# EAGLE schematic CHIP_PRO-Dev-Kit-v1.0 (EAGLE 8.2.2)

## Sheet 1 of 5
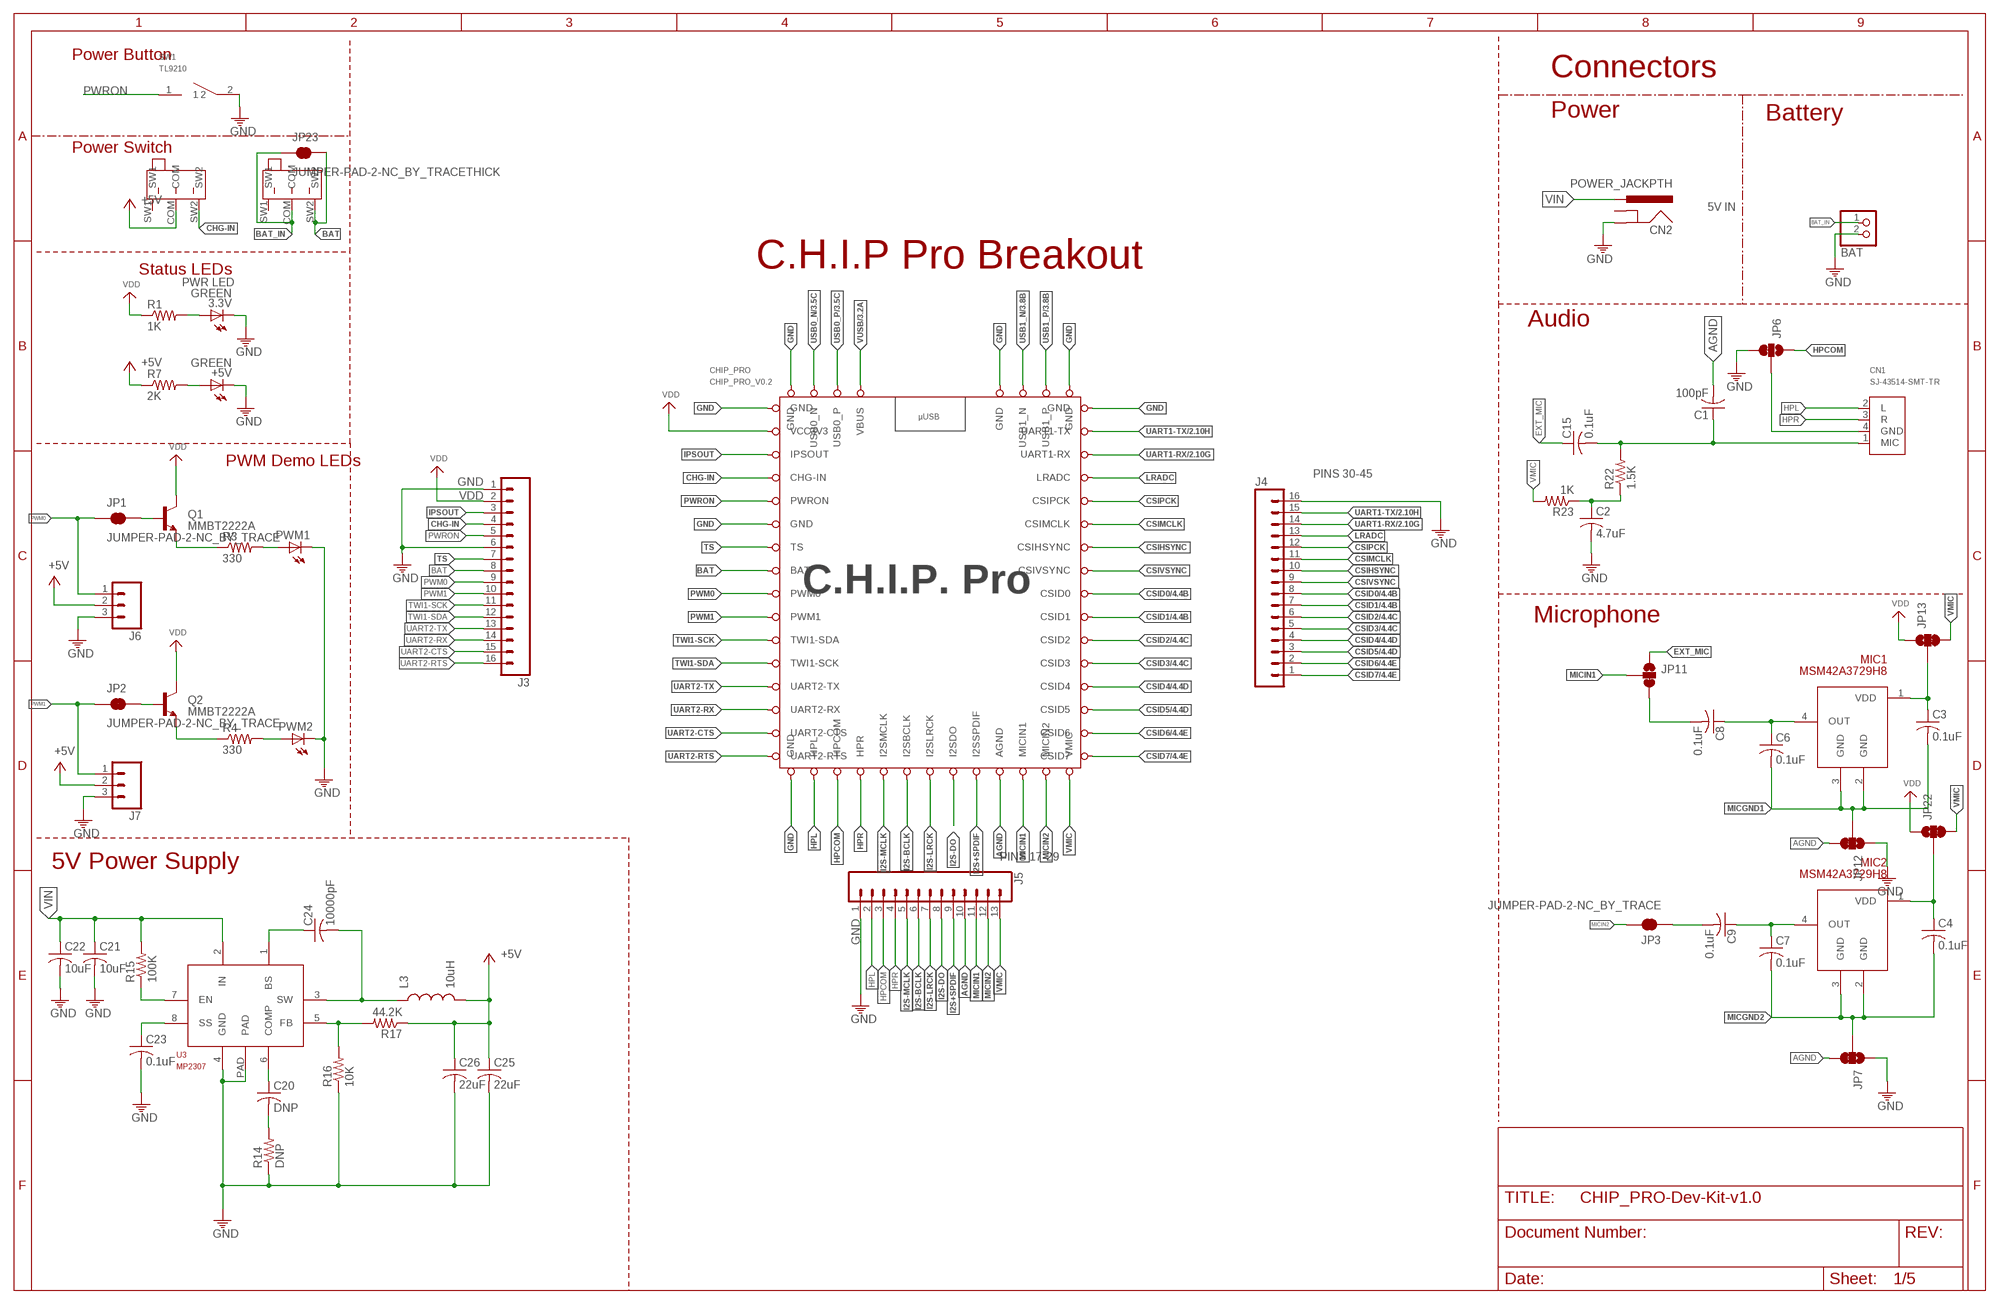
[diagram p0: schematic, sheet 1]

### Parts
3.3V  GREEN  LEDSMT1206  [1206]
+5V  GREEN  LEDSMT1206  [1206]
BAT  JST_2PIN-SMT-RA  [JST-PH-2-SMT-RA]
C1  100pF  C-USC0402  [C0402]
C2  4.7uF  C-USC0402  [C0402]
C3  0.1uF  C-USC0402  [C0402]
C4  0.1uF  C-USC0402  [C0402]
C6  0.1uF  C-USC0402  [C0402]
C7  0.1uF  C-USC0402  [C0402]
C8  0.1uF  C-USC0402  [C0402]
C9  0.1uF  C-USC0402  [C0402]
C15  0.1uF  C-USC0402  [C0402]
C20  DNP  C-USC0402  [C0402]
C21  10uF  C-USC0603  [C0603]
C22  10uF  C-USC0603  [C0603]
C23  0.1uF  C-USC0402  [C0402]
C24  10000pF  C-USC0603  [C0603]
C25  22uF  C-USC0805  [C0805]
C26  22uF  C-USC0805  [C0805]
CHIP_PRO  CHIP_PRO_V0.2  GR8_MODULE_V0.1  [GR8_MODULE_V0.2]
CN1  SJ-43514-SMT-TR  [SJ-43514-SMT-TR]
CN2  POWER_JACKPTH  [POWER_JACK_PTH]
J3  M16LOCK_LONGPADS  [1X16_LOCK_LONGPADS]
J4  M16LOCK_LONGPADS  [1X16_LOCK_LONGPADS]
J5  M13LOCK  [1X13_LOCK]
J6  M03LOCK  [1X03_LOCK]
J7  M03LOCK  [1X03_LOCK]
JP1  JUMPER-PAD-2-NC_BY_TRACE  [PAD-JUMPER-2-NC_BY_TRACE_YES_SILK]
JP2  JUMPER-PAD-2-NC_BY_TRACE  [PAD-JUMPER-2-NC_BY_TRACE_YES_SILK]
JP3  JUMPER-PAD-2-NC_BY_TRACE  [PAD-JUMPER-2-NC_BY_TRACE_YES_SILK]
JP6  JUMPER-PAD-3-2OF3_NC_BY_TRACE_LARGE  [PAD-JUMPER-3-2OF3_NC_BY_TRACE_YES_SILK_LARGE]
JP7  JUMPER-PAD-3-2OF3_NC_BY_TRACE_LARGE  [PAD-JUMPER-3-2OF3_NC_BY_TRACE_YES_SILK_LARGE]
JP11  JUMPER-PAD-3-2OF3_NC_BY_TRACE_LARGE  [PAD-JUMPER-3-2OF3_NC_BY_TRACE_YES_SILK_LARGE]
JP12  JUMPER-PAD-3-2OF3_NC_BY_TRACE_LARGE  [PAD-JUMPER-3-2OF3_NC_BY_TRACE_YES_SILK_LARGE]
JP13  JUMPER-PAD-3-2OF3_NC_BY_TRACE_LARGE  [PAD-JUMPER-3-2OF3_NC_BY_TRACE_YES_SILK_LARGE]
JP22  JUMPER-PAD-3-2OF3_NC_BY_TRACE_LARGE  [PAD-JUMPER-3-2OF3_NC_BY_TRACE_YES_SILK_LARGE]
JP23  JUMPER-PAD-2-NC_BY_TRACETHICK  [PAD-JUMPER-2-NC_BY_TRACE_YES_SILK_THICK]
L3  10uH  INDUCTORNR8040  [INDUCTOR_NR8040]
MIC1  MSM42A3729H8  [MSM42A3729H8]
MIC2  MSM42A3729H8  [MSM42A3729H8]
PWM1  LEDSMT1206  [1206]
PWM2  LEDSMT1206  [1206]
Q1  MMBT2222A  TRANSISTOR_NPNMMBT2222A  [SOT23-3]
Q2  MMBT2222A  TRANSISTOR_NPNMMBT2222A  [SOT23-3]
R1  1K  R-US_R0603  [R0603]
R3  330  R-US_R0603  [R0603]
R4  330  R-US_R0603  [R0603]
R7  2K  R-US_R0603  [R0603]
R14  DNP  R-US_R0402  [R0402]
R15  100K  R-US_R0402  [R0402]
R16  10K  R-US_R0402  [R0402]
R17  44.2K  R-US_R0402  [R0402]
R22  1.5K  R-US_R0402  [R0402]
R23  1K  R-US_R0402  [R0402]
SW1  TL9210  [TL9210_SW]
SW2  SLIDE_SWITCHESYSS-19-1202-N  [YSS-19-1202-N]
SW3  SLIDE_SWITCHESYSS-19-1202-N  [YSS-19-1202-N]
U3  MP2307  [SOIC-8-PAD]

### Nets
+5V: C25.1 C26.1 J6.2 J7.2 L3.P$2 R7.1 R17.1 SW2.COM ; also sheet 3
AGND: C1.2 CHIP_PRO.AGND J5.10 JP7.3 JP12.3
BAT: CHIP_PRO.BAT J3.8 JP23.2 SW3.SW2
BAT_IN: BAT.1 JP23.1 SW3.COM
CHG-IN: CHIP_PRO.CHG-IN J3.4 SW2.SW2
CSID0: CHIP_PRO.CSID0 J4.8 ; also sheet 4
CSID1: CHIP_PRO.CSID1 J4.7 ; also sheet 4
CSID2: CHIP_PRO.CSID2 J4.6 ; also sheet 4
CSID3: CHIP_PRO.CSID3 J4.5 ; also sheet 4
CSID4: CHIP_PRO.CSID4 J4.4 ; also sheet 4
CSID5: CHIP_PRO.CSID5 J4.3 ; also sheet 4
CSID6: CHIP_PRO.CSID6 J4.2 ; also sheet 4
CSID7: CHIP_PRO.CSID7 J4.1 ; also sheet 4
CSIHSYNC: CHIP_PRO.CSIHSYNC J4.10
CSIMCLK: CHIP_PRO.CSIMCLK J4.11
CSIPCK: CHIP_PRO.CSIPCK J4.12
CSIVSYNC: CHIP_PRO.CSIVSYNC J4.9
EXT_MIC: C15.1 JP11.1
GND: 3.3V.C +5V.C BAT.2 C2.2 C21.2 C22.2 C23.2 C25.2 C26.2 CHIP_PRO.GND@0(GND) CHIP_PRO.GND@1(GND) CHIP_PRO.GND@2(GND) CHIP_PRO.GND@3(GND) CHIP_PRO.GND@4(GND) CHIP_PRO.GND@6(GND) CHIP_PRO.GND@7(GND) CN2.GND J3.1 J3.6 J4.16 J5.1 J6.3 J7.3 JP6.3 JP7.1 JP12.1 PWM1.C PWM2.C R14.1 R16.1 SW1.2 U3.4(GND) U3.PAD ; also sheet 2,3,4
HPCOM: CHIP_PRO.HPCOM J5.3 JP6.1
HPL: CHIP_PRO.HPL CN1.2(L) J5.2
HPR: CHIP_PRO.HPR CN1.3(R) J5.4
I2S+SPDIF: CHIP_PRO.I2S+SPDIF(I2SSPDIF) J5.9
I2S-BCLK: CHIP_PRO.I2S-BCLK(I2SBCLK) J5.6
I2S-DO: CHIP_PRO.I2S-DO(I2SDO) J5.8
I2S-LRCK: CHIP_PRO.I2S-LRCK(I2SLRCK) J5.7
I2S-MCLK: CHIP_PRO.I2S-MCLK(I2SMCLK) J5.5
IPSOUT: CHIP_PRO.IPSOUT J3.3
LRADC: CHIP_PRO.LRADC J4.13
MICGND1: C3.2 C6.2 JP12.2 MIC1.2(GND) MIC1.3(GND)
MICGND2: C4.2 C7.2 JP7.2 MIC2.2(GND) MIC2.3(GND)
MICIN1: CHIP_PRO.MICIN1 J5.11 JP11.2
MICIN2: CHIP_PRO.MICIN2 J5.12 JP3.2
N$1: 3.3V.A R1.2
N$2: C3.1 JP13.2 MIC1.1(VDD)
N$3: C6.1 C8.1 MIC1.4(OUT)
N$4: JP1.2 Q1.1(B)
N$5: JP2.2 Q2.1(B)
N$6: C8.2 JP11.3
N$8: Q1.2(E) R3.1
N$9: PWM1.A R3.2
N$10: Q2.2(E) R4.1
N$11: PWM2.A R4.2
N$18: R15.1 U3.7(EN)
N$19: C23.1 U3.8(SS)
N$21: CN1.4(GND) JP6.2
N$22: C20.2 R14.2
N$23: C20.1 U3.6(COMP)
N$24: C24.1 U3.1(BS)
N$25: C24.2 L3.P$1 U3.3(SW)
N$26: C1.1 C15.2 CN1.1(MIC) R22.2
N$27: R16.2 R17.2 U3.5(FB)
N$28: C2.1 R22.1 R23.1
N$32: +5V.A R7.2
N$34: C7.1 C9.1 MIC2.4(OUT)
N$35: C4.1 JP22.2 MIC2.1(VDD)
N$48: C9.2 JP3.1
PWM0: CHIP_PRO.PWM0 J3.9 J6.1 JP1.1
PWM1: CHIP_PRO.PWM1 J3.10 J7.1 JP2.1
PWRON: CHIP_PRO.PWRON J3.5 SW1.1
TS: CHIP_PRO.TS J3.7
TWI1-SCK: CHIP_PRO.TWI1-SDA J3.11
TWI1-SDA: CHIP_PRO.TWI1-SCK J3.12
UART1-RX: CHIP_PRO.UART1-RX J4.14 ; also sheet 2
UART1-TX: CHIP_PRO.UART1-TX J4.15 ; also sheet 2
UART2-CTS: CHIP_PRO.UART2-CTS J3.15
UART2-RTS: CHIP_PRO.UART2-RTS J3.16
UART2-RX: CHIP_PRO.UART2-RX J3.14
UART2-TX: CHIP_PRO.UART2-TX J3.13
USB0_N: CHIP_PRO.USB0_N ; also sheet 3
USB0_P: CHIP_PRO.USB0_P ; also sheet 3
USB1_N: CHIP_PRO.USB1_N ; also sheet 3
USB1_P: CHIP_PRO.USB1_P ; also sheet 3
VDD: CHIP_PRO.VCC3V3 J3.2 JP13.1 JP22.1 Q1.3(C) Q2.3(C) R1.1 ; also sheet 2,3,4
VIN: C21.1 C22.1 CN2.PWR R15.2 U3.2(IN)
VMIC: CHIP_PRO.VMIC J5.13 JP13.3 JP22.3 R23.2
VUSB: CHIP_PRO.VBUS ; also sheet 3
Unconnected: CN2.GNDBREAK SW2.SW1 SW3.SW1

### Notes on the sheet
- Power Button
- Connectors
- Power | Battery
- Power Switch
- 5V IN
- C.H.I.P Pro Breakout
- Status LEDs
- PWR LED
- Audio
- PWM Demo LEDs
- PINS 30-45
- Microphone
- PINS 17-29
- 5V Power Supply

## Sheet 2 of 5
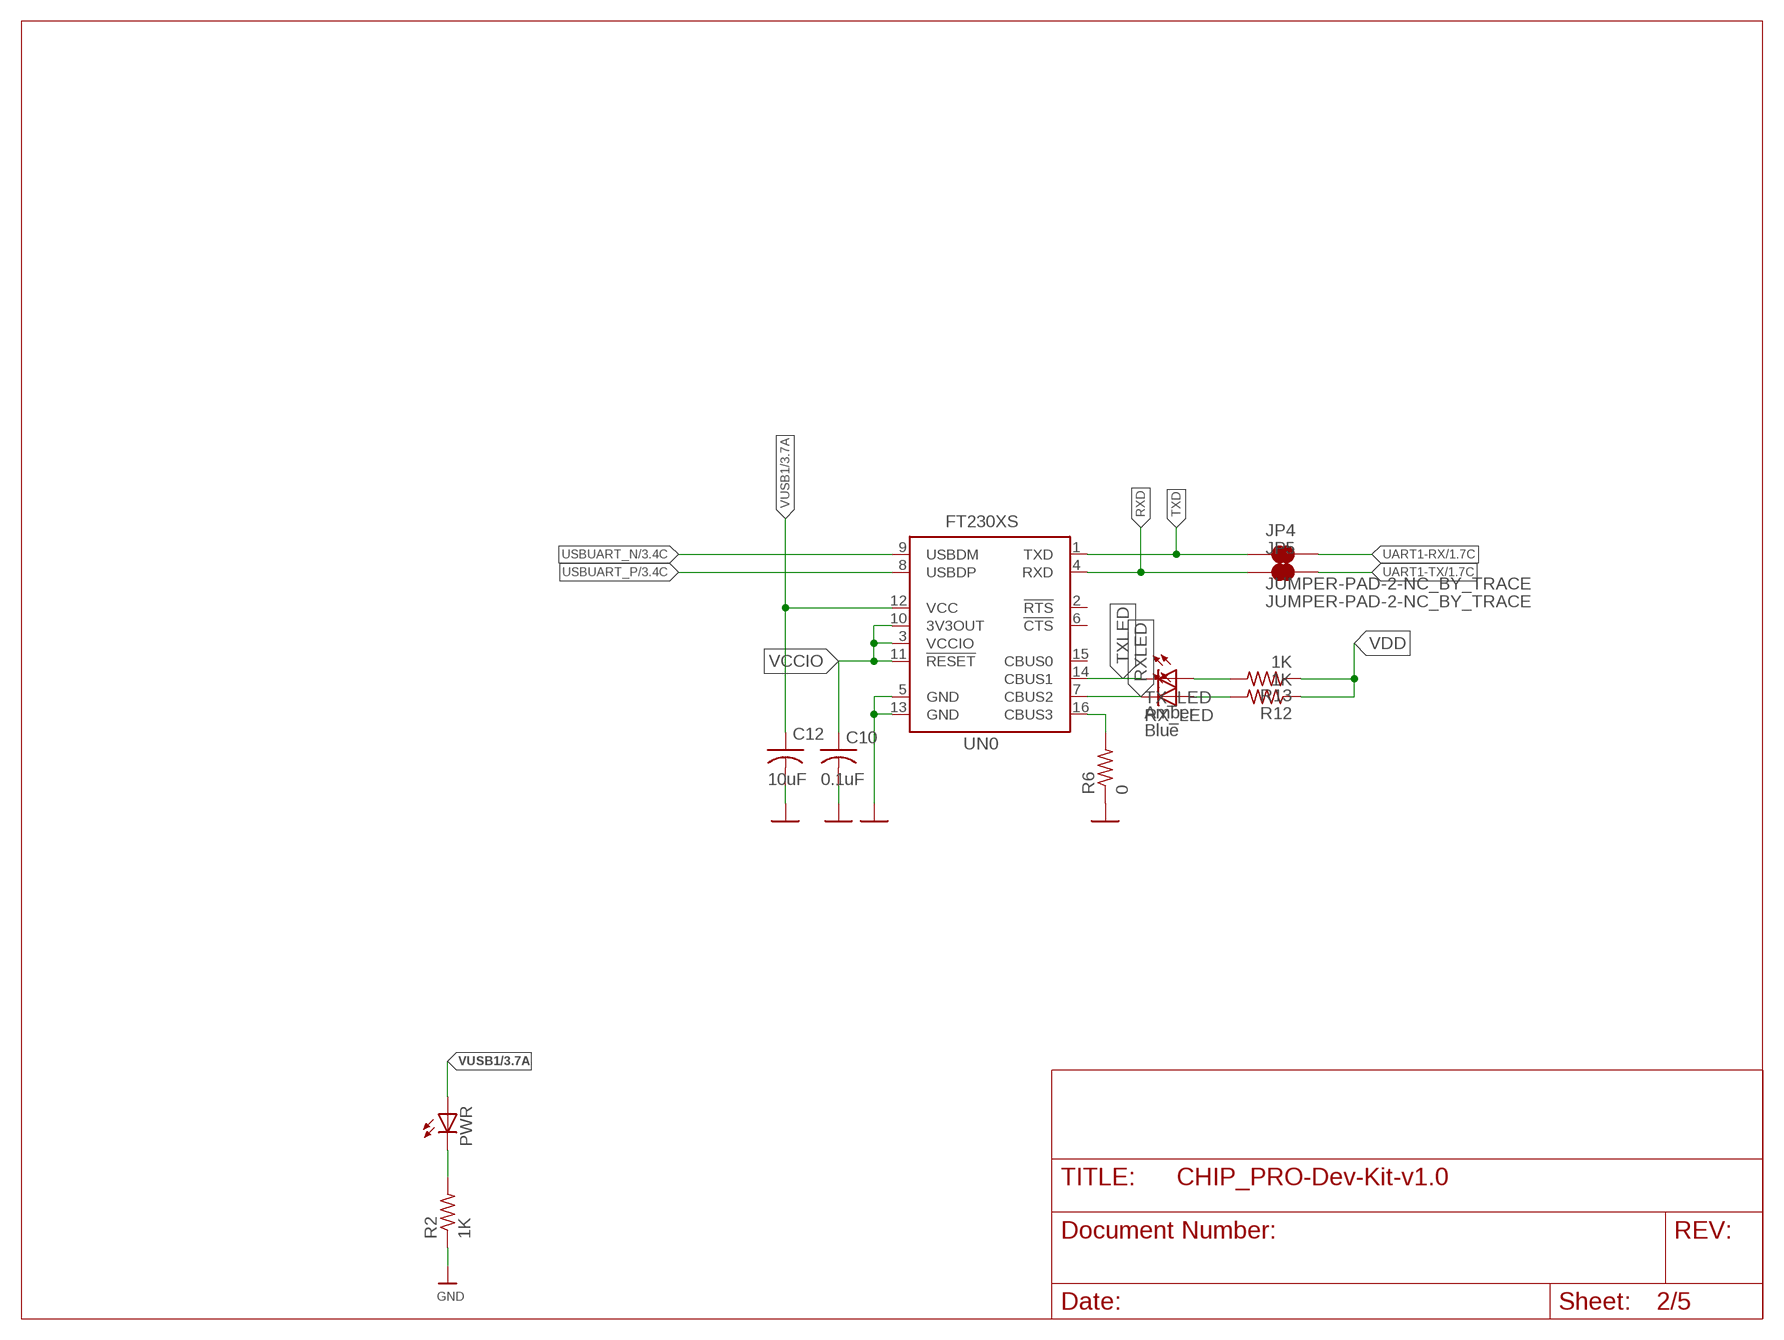
[diagram p1: schematic, sheet 2]

### Parts
C10  0.1uF  C-USC0402  [C0402]
C12  10uF  C-USC0402  [C0402]
JP4  JUMPER-PAD-2-NC_BY_TRACE  [PAD-JUMPER-2-NC_BY_TRACE_YES_SILK]
JP5  JUMPER-PAD-2-NC_BY_TRACE  [PAD-JUMPER-2-NC_BY_TRACE_YES_SILK]
PWR  LED805  [LED-805]
R2  1K  R-US_R0402  [R0402]
R6  0  R-US_R0402  [R0402]
R12  1K  R-US_R0402  [R0402]
R13  1K  R-US_R0402  [R0402]
RX_LED  Blue  LED805  [LED-805]
TX_LED  Amber  LED805  [LED-805]
UN0  FT230XS  [SSOP-16]

### Nets
GND: C10.2 C12.2 R2.1 R6.1 UN0.5(GND) UN0.13(GND) ; also sheet 1,3,4
N$14: PWR.C R2.2
N$15: R12.2 RX_LED.A
N$16: R13.2 TX_LED.A
N$58: R6.2 UN0.16(CBUS3)
RXD: JP5.1 UN0.4(RXD)
RXLED: RX_LED.C UN0.7(CBUS2)
TXD: JP4.1 UN0.1(TXD)
TXLED: TX_LED.C UN0.14(CBUS1)
UART1-RX: JP4.2 ; also sheet 1
UART1-TX: JP5.2 ; also sheet 1
USBUART_N: UN0.9(USBDM) ; also sheet 3
USBUART_P: UN0.8(USBDP) ; also sheet 3
VCCIO: C10.1 UN0.3(VCCIO) UN0.10(3V3OUT) UN0.11(!RESET)
VDD: R12.1 R13.1 ; also sheet 1,3,4
VUSB1: C12.1 PWR.A UN0.12(VCC) ; also sheet 3
Unconnected: UN0.2(!RTS) UN0.6(!CTS) UN0.15(CBUS0)

## Sheet 3 of 5
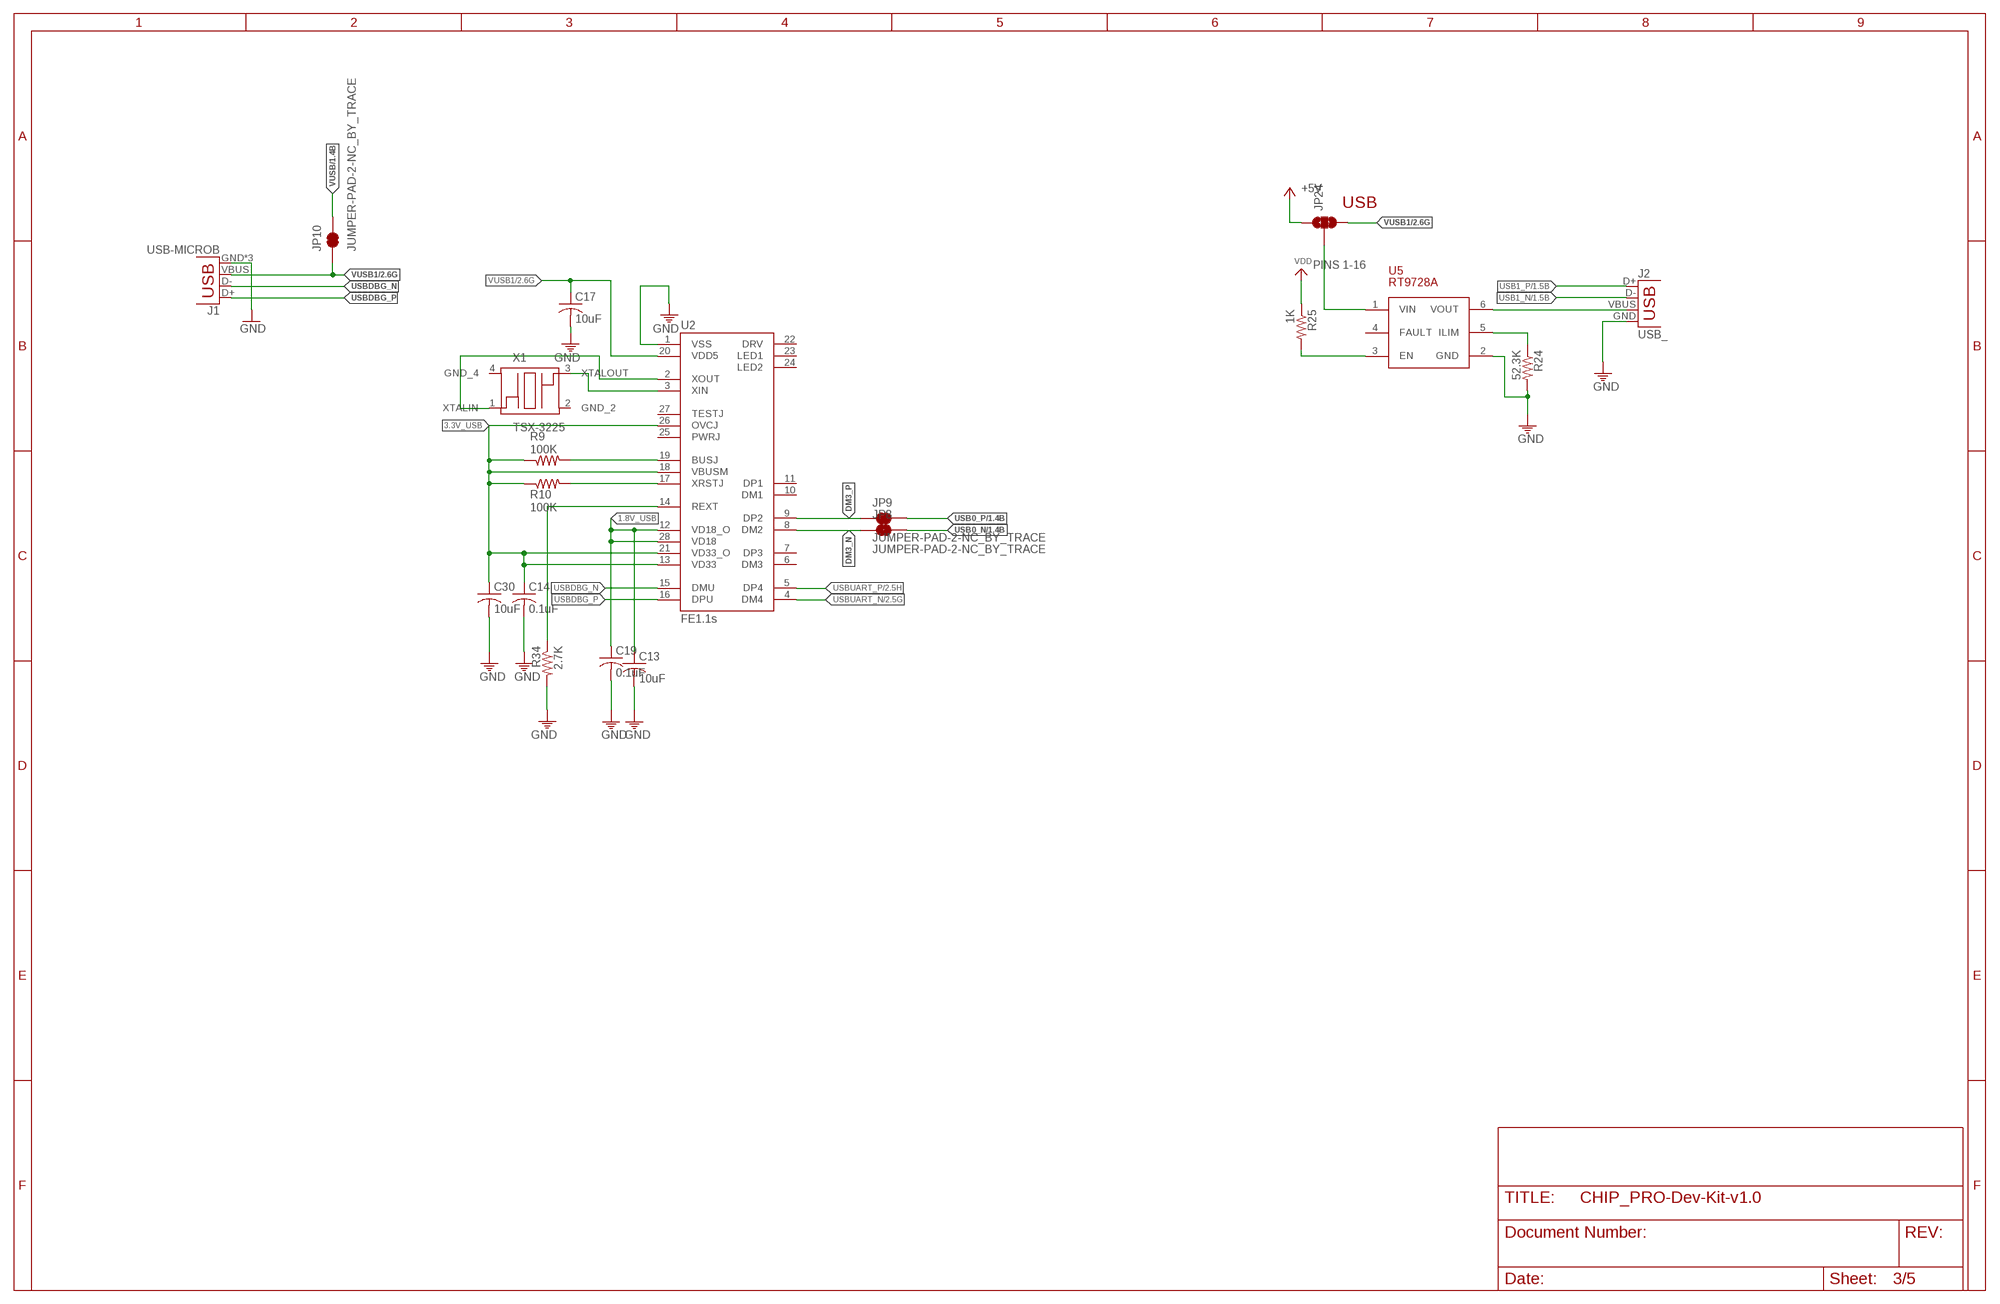
[diagram p2: schematic, sheet 3]

### Parts
C13  10uF  C-USC0603  [C0603]
C14  0.1uF  C-USC0402  [C0402]
C17  10uF  C-USC0603  [C0603]
C19  0.1uF  C-USC0402  [C0402]
C30  10uF  C-USC0603  [C0603]
J1  USB-MICROB  [USB-MICROB]
J2  USB_  [USB-A-S-SILK-FEMALE]
JP8  JUMPER-PAD-2-NC_BY_TRACE  [PAD-JUMPER-2-NC_BY_TRACE_YES_SILK]
JP9  JUMPER-PAD-2-NC_BY_TRACE  [PAD-JUMPER-2-NC_BY_TRACE_YES_SILK]
JP10  JUMPER-PAD-2-NC_BY_TRACE  [PAD-JUMPER-2-NC_BY_TRACE_YES_SILK]
JP24  JUMPER-PAD-3-2OF3_NC_BY_TRACE_LARGE  [PAD-JUMPER-3-2OF3_NC_BY_TRACE_YES_SILK_LARGE]
R9  100K  R-US_R0402  [R0402]
R10  100K  R-US_R0402  [R0402]
R24  52.3K  R-US_R0402  [R0402]
R25  1K  R-US_R0402  [R0402]
R34  2.7K  R-US_R0402  [R0402]
U2  FE1.1S  [FE1.1S_SSOP-28]
U5  RT9728A  [SOT-23-6]
X1  TSX-3225  [TSX-3225]

### Nets
1.8V_USB: C13.1 C19.1 U2.12(VD18_O) U2.28(VD18)
3.3V_USB: C14.1 C30.1 R9.1 R10.1 U2.13(VD33) U2.18(VBUSM) U2.21(VD33_O) U2.26(OVCJ)
+5V: JP24.1 ; also sheet 1
DM3_N: JP8.1 U2.8(DM2)
DM3_P: JP9.1 U2.9(DP2)
GND: C13.2 C14.2 C17.2 C19.2 C30.2 J1.GND J1.MT1(GND) J1.MT2(GND) J2.GND R24.2 R34.2 U2.1(VSS) U5.2(GND) ; also sheet 1,2,4
N$12: R9.2 U2.19(BUSJ)
N$13: JP24.2 U5.1(VIN)
N$17: J2.VBUS U5.6(VOUT)
N$20: R34.1 U2.14(REXT)
N$30: U2.3(XIN) X1.3(XTALOUT)
N$31: R10.2 U2.17(XRSTJ)
N$33: R25.2 U5.3(EN)
N$36: R24.1 U5.5(ILIM)
N$49: U2.2(XOUT) X1.1(XTALIN)
USB0_N: JP8.2 ; also sheet 1
USB0_P: JP9.2 ; also sheet 1
USB1_N: J2.D- ; also sheet 1
USB1_P: J2.D+ ; also sheet 1
USBDBG_N: J1.D- U2.15(DMU)
USBDBG_P: J1.D+ U2.16(DPU)
USBUART_N: U2.4(DM4) ; also sheet 2
USBUART_P: U2.5(DP4) ; also sheet 2
VDD: R25.1 ; also sheet 1,2,4
VUSB: JP10.2 ; also sheet 1
VUSB1: C17.1 J1.VBUS JP10.1 JP24.3 U2.20(VDD5) ; also sheet 2
Unconnected: U2.6(DM3) U2.7(DP3) U2.10(DM1) U2.11(DP1) U2.22(DRV) U2.23(LED1) U2.24(LED2) U2.25(PWRJ) U2.27(TESTJ) U5.4(FAULT) X1.2(GND_2) X1.4(GND_4)

### Notes on the sheet
- USB
- PINS 1-16

## Sheet 4 of 5
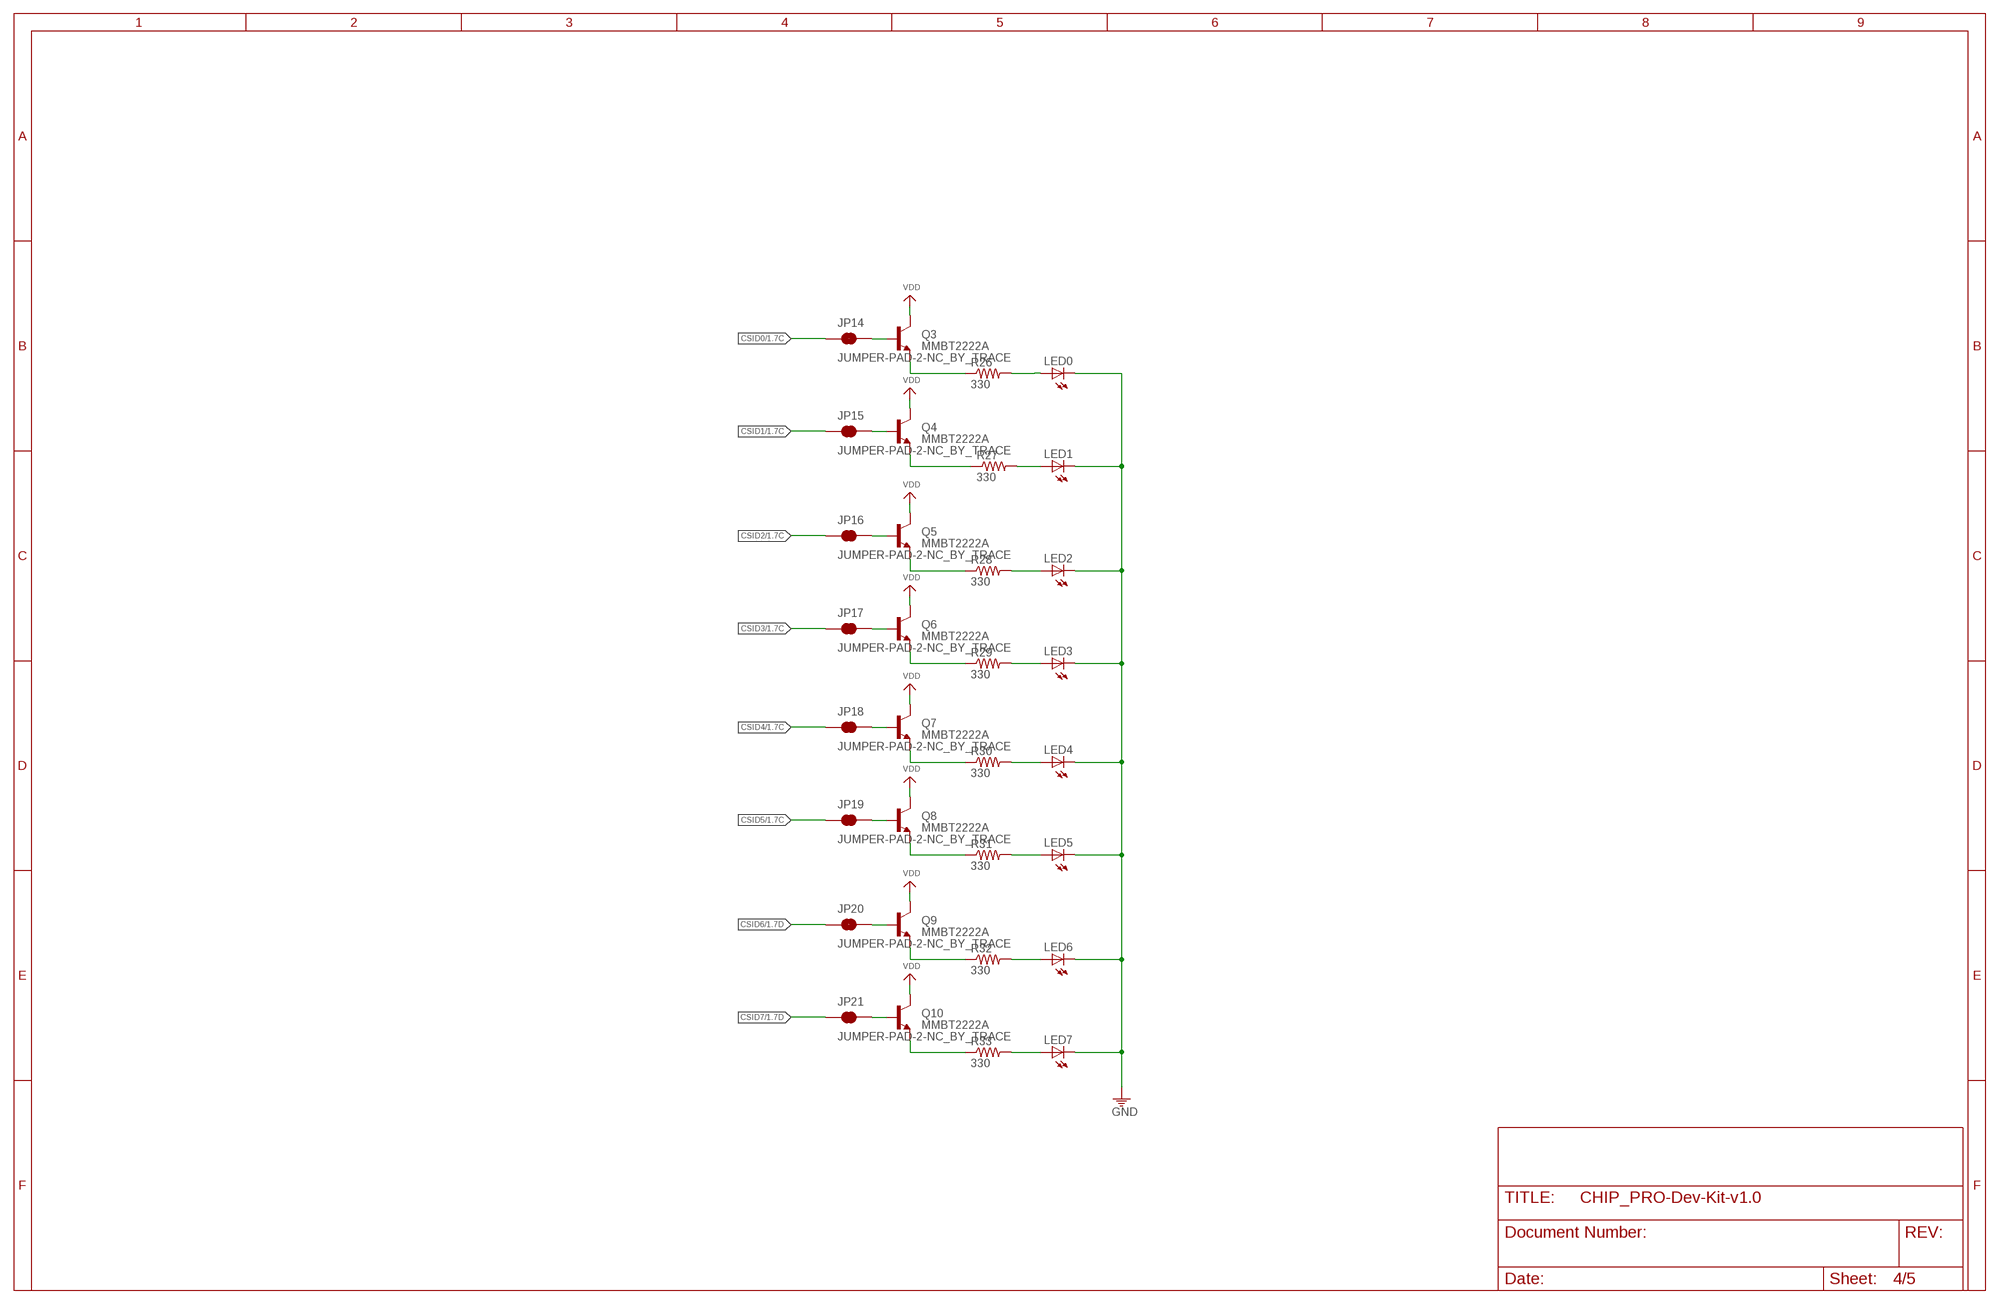
[diagram p3: schematic, sheet 4]

### Parts
JP14  JUMPER-PAD-2-NC_BY_TRACE  [PAD-JUMPER-2-NC_BY_TRACE_YES_SILK]
JP15  JUMPER-PAD-2-NC_BY_TRACE  [PAD-JUMPER-2-NC_BY_TRACE_YES_SILK]
JP16  JUMPER-PAD-2-NC_BY_TRACE  [PAD-JUMPER-2-NC_BY_TRACE_YES_SILK]
JP17  JUMPER-PAD-2-NC_BY_TRACE  [PAD-JUMPER-2-NC_BY_TRACE_YES_SILK]
JP18  JUMPER-PAD-2-NC_BY_TRACE  [PAD-JUMPER-2-NC_BY_TRACE_YES_SILK]
JP19  JUMPER-PAD-2-NC_BY_TRACE  [PAD-JUMPER-2-NC_BY_TRACE_YES_SILK]
JP20  JUMPER-PAD-2-NC_BY_TRACE  [PAD-JUMPER-2-NC_BY_TRACE_YES_SILK]
JP21  JUMPER-PAD-2-NC_BY_TRACE  [PAD-JUMPER-2-NC_BY_TRACE_YES_SILK]
LED0  LEDSMT1206  [1206]
LED1  LEDSMT1206  [1206]
LED2  LEDSMT1206  [1206]
LED3  LEDSMT1206  [1206]
LED4  LEDSMT1206  [1206]
LED5  LEDSMT1206  [1206]
LED6  LEDSMT1206  [1206]
LED7  LEDSMT1206  [1206]
Q3  MMBT2222A  TRANSISTOR_NPNMMBT2222A  [SOT23-3]
Q4  MMBT2222A  TRANSISTOR_NPNMMBT2222A  [SOT23-3]
Q5  MMBT2222A  TRANSISTOR_NPNMMBT2222A  [SOT23-3]
Q6  MMBT2222A  TRANSISTOR_NPNMMBT2222A  [SOT23-3]
Q7  MMBT2222A  TRANSISTOR_NPNMMBT2222A  [SOT23-3]
Q8  MMBT2222A  TRANSISTOR_NPNMMBT2222A  [SOT23-3]
Q9  MMBT2222A  TRANSISTOR_NPNMMBT2222A  [SOT23-3]
Q10  MMBT2222A  TRANSISTOR_NPNMMBT2222A  [SOT23-3]
R26  330  R-US_R0603  [R0603]
R27  330  R-US_R0603  [R0603]
R28  330  R-US_R0603  [R0603]
R29  330  R-US_R0603  [R0603]
R30  330  R-US_R0603  [R0603]
R31  330  R-US_R0603  [R0603]
R32  330  R-US_R0603  [R0603]
R33  330  R-US_R0603  [R0603]

### Nets
CSID0: JP14.1 ; also sheet 1
CSID1: JP15.1 ; also sheet 1
CSID2: JP16.1 ; also sheet 1
CSID3: JP17.1 ; also sheet 1
CSID4: JP18.1 ; also sheet 1
CSID5: JP19.1 ; also sheet 1
CSID6: JP20.1 ; also sheet 1
CSID7: JP21.1 ; also sheet 1
GND: LED0.C LED1.C LED2.C LED3.C LED4.C LED5.C LED6.C LED7.C ; also sheet 1,2,3
N$37: JP14.2 Q3.1(B)
N$39: Q3.2(E) R26.1
N$40: JP15.2 Q4.1(B)
N$41: Q4.2(E) R27.1
N$42: JP16.2 Q5.1(B)
N$43: Q5.2(E) R28.1
N$44: JP17.2 Q6.1(B)
N$46: Q6.2(E) R29.1
N$47: JP18.2 Q7.1(B)
N$50: Q7.2(E) R30.1
N$51: JP19.2 Q8.1(B)
N$52: Q8.2(E) R31.1
N$53: JP20.2 Q9.1(B)
N$54: Q9.2(E) R32.1
N$55: JP21.2 Q10.1(B)
N$56: Q10.2(E) R33.1
N$68: LED7.A R33.2
N$69: LED6.A R32.2
N$70: LED5.A R31.2
N$71: LED4.A R30.2
N$72: LED3.A R29.2
N$73: LED2.A R28.2
N$74: LED1.A R27.2
N$75: LED0.A R26.2
VDD: Q3.3(C) Q4.3(C) Q5.3(C) Q6.3(C) Q7.3(C) Q8.3(C) Q9.3(C) Q10.3(C) ; also sheet 1,2,3

## Sheet 5 of 5

## Library data of the parts
3.3V +5V LED0 LED1-LED7 PWM1 PWM2 = adafruit:LED: LED OSRAM: - CHIPLED LG R971, LG N971, LY N971, LG Q971, LY Q971, LO R971, LY R971 LH N974, LH R974 LS Q976, LO Q976, LY Q976 LO Q996 - Hyper CHIPLED LW Q18S LB Q993, LB Q99A, LB R99A - SideLED LS A670, LO A670, LY A670, LG A670, LP A670 LB A673, LV A673, LT A673, LW A673 LH A674 LY A675 LS A676, LA A676, LO A676, LY A676, LW A676 LS A679, LY A679, LG A679 - Hyper Micro SIDELED® LS Y876, LA Y876, LO Y876, LY Y876 LT Y87S - SmartLED LW L88C, LW L88S LB L89C, LB L89S, LG L890 LS L89K, LO L89K, LY L89K LS L896, LA L896, LO L896, LY L896 - TOPLED LS T670, LO T670, LY T670, LG T670, LP T670 LSG T670, LSP T670, LSY T670, LOP T670, LYG T670 LG T671, LOG T671, LSG T671 LB T673, LV T673, LT T673, LW T673 LH T674 LS T676, LA T676, LO T676, LY T676, LB T676, LH T676, LSB T676, LW T676 LB T67C, LV T67C, LT T67C, LS T67K, LO T67K, LY T67K, LW E67C LS E67B, LA E67B, LO E67B, LY E67B, LB E67C, LV E67C, LT E67C LW T67C LS T679, LY T679, LG T679 LS T770, LO T770, LY T770, LG T770, LP T770 LB T773, LV T773, LT T773, LW T773 LH T774 LS E675, LA E675, LY E675, LS T675 LS T776, LA T776, LO T776, LY T776, LB T776 LHGB T686 LT T68C, LB T68C - Hyper Mini TOPLED® LB M676 - Mini TOPLED Santana® LG M470 LS M47K, LO M47K, LY M47K Source: http://www.osram.convergy.de/
BAT = NTC-CHIP:JST_2PIN: JST 2-Pin Connectors of various flavors SMT-RA (S2B-PH-SM4) 4UConnector #17311 SMT (B2B-PH-SM4) THM-RA (S2B-PH) THM (B2B-PH)
C1-C4 C6-C9 C15 = resistor:C-US: CAPACITOR, American symbol
C10 C12 C24-C26 = CHIP_PRO_Dev-Kit-v0.1:C-US: CAPACITOR, American symbol
C13 C14 C17 C19 C30 = GR8_Module-Eval-v0.2:C-US: CAPACITOR, American symbol
C20-C23 = GR8_Module-Eval-v0.1:C-US: CAPACITOR, American symbol
CHIP_PRO = CHIP_PRO_Dev-Kit-v0.1:GR8_MODULE_V0.1
CN1 = NTC-CHIP:SJ-43514-SMT-TR
CN2 = SparkFun-Connectors:POWER_JACK: Power Jack This is the standard 5.5mm barrel jack for power. The PTH is the most common, proven, reliable, footprint. The Slot footprint only works if the mill layer is transmitted to the PCB fab house so be warned. Mating wall wart : TOL-00298 (and others); PROD_ID: CONN-08197
J1 = SparkFun-Connectors:USB: USB Connectors USB-B-PTH is fully proven SKU : PRT-00139/CONN-08278 USB-miniB is fully proven SKU : PRT-00587 USB-A-PCB is untested. USB-A-H is throughly reviewed, but untested. Spark Fun Electronics SKU : PRT-00437 USB-B-SMT is throughly reviewed, but untested. Needs silkscreen touching up. USB-A-S has not been used/tested USB-MB-H has not been used/tested USB-MICROB has been used. CONN-09505; PROD_ID: CONN-09505
J2 = SparkFun-Connectors:USB: USB Connectors USB-B-PTH is fully proven SKU : PRT-00139/CONN-08278 USB-miniB is fully proven SKU : PRT-00587 USB-A-PCB is untested. USB-A-H is throughly reviewed, but untested. Spark Fun Electronics SKU : PRT-00437 USB-B-SMT is throughly reviewed, but untested. Needs silkscreen touching up. USB-A-S has not been used/tested USB-MB-H has not been used/tested USB-MICROB has been used. CONN-09505
J3 J4 = SparkFun-Connectors:M16: 1x16 .1" header
J5 = SparkFun-Connectors:M13: 13-pin single row .1" header
J6 J7 = CHIP_PRO_Dev-Kit-v0.1:M03: Header 3 Standard 3-pin 0.1" header. Use with straight break away headers (SKU : PRT-00116), right angle break away headers (PRT-00553), swiss pins (PRT-00743), machine pins (PRT-00117), and female headers (PRT-00115). Molex polarized connector foot print use with SKU : PRT-08232 with associated crimp pins and housings.
JP1-JP5 JP8-JP10 JP23 = CHIP_PRO_Dev-Kit-v0.1:JUMPER-PAD-2-NC_BY_TRACE
JP6 JP7 JP11-JP13 JP22 JP24 = SparkFun-Passives:JUMPER-PAD-3-2OF3_NC_BY_TRACE
JP14-JP21 = SparkFun-Passives:JUMPER-PAD-2-NC_BY_TRACE
L3 = GR8_Module-Eval-v0.1:INDUCTOR: Inductors; PROD_ID: NDUC-12529; VALUE: 27uH
MIC1 MIC2 = CHIP_PRO_Dev-Kit-v0.1:MSM42A3729H8
PWR RX_LED TX_LED = dp_devices:LED
Q1-Q10 = SparkFun-DiscreteSemi:TRANSISTOR_NPN: Generic NPN BJT MMBT2222A - TRANS-08049 (SOT-23, 1A 40V) MPSA42 - TRANS-09116 (SOT-23, 500mA 300V) MMBT5088LT1G - TRANS-11160 (SOT-23, 50 mA 30V) BC547 - COM-08928 <http://www.sparkfun.com/products/8928> (TO-92 45V 100mA) (1.Collector 2.Base 3.Emitter) 2N3904 - COM-00521 <http://www.sparkfun.com/products/521> (TO-92 40V 200mA) (1.Emitter 2.Base 3.Collector) P2N2222A - COM-12852 <http://www.sparkfun.com/products/12852> (TO-92 40V 600mA) (1.Collector 2.Base 3.Emitter); PROD_ID: TRANS-08049
R1 R3 R4 R7 R26-R33 = adafruit:R-US_: RESISTOR, American symbol
R2 R12-R17 = GR8_Module-Eval-v0.1:R-US_: RESISTOR, American symbol
R6 = CHIP_PRO_Dev-Kit-v0.1:R-US_: RESISTOR, American symbol
R9 R10 R22-R25 R34 = resistor:R-US_: RESISTOR, American symbol
SW1 = CHEEPER-REV0.51A:TL9210
SW2 SW3 = NTC-CHIP:SLIDE_SWITCHES
U2 = imcom:FE1.1S: A USB 2.0 hub IC. http://www.jfd-ic.com/Documents/FE1.1s%20Data%20Sheet%20%28Rev.%201.0%29.pdf
U3 = GR8_Module-Eval-v0.1:MP2307
U5 = RT9728A:RT9728A
UN0 = ftdichip:FT230X
X1 = crystals:TSX-3225